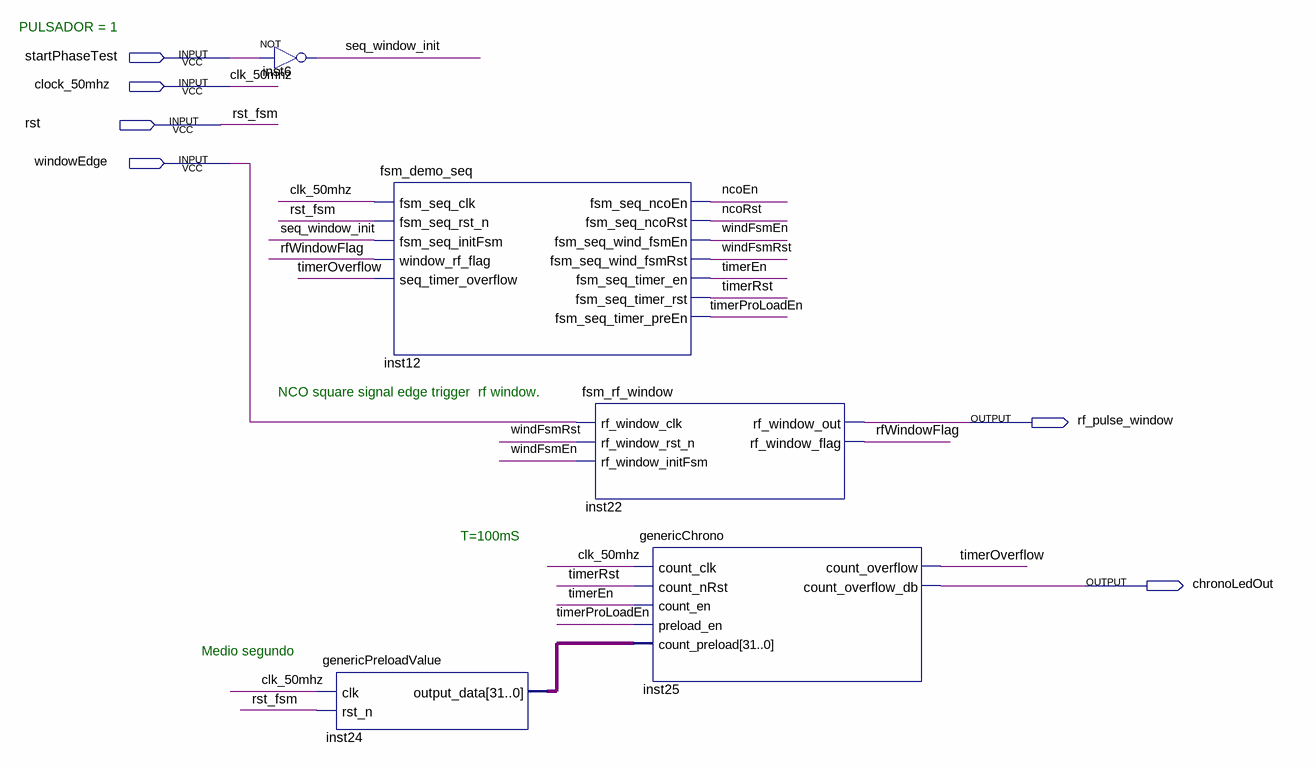
[diagram p0: schematic sheet]
// Quartus schematic block_nco_rf_pulse.bdf as structural Verilog: 5 symbols, 6 pins
module block_nco_rf_pulse (
  input  startPhaseTest,
  input  clock_50mhz,
  input  rst,
  input  windowEdge,
  output rf_pulse_window,
  output chronoLedOut
);

  wire ncoEn, ncoRst, rfWindowFlag, seq_window_init, timerEn, timerOverflow, timerProLoadEn, timerRst,
       windFsmEn, windFsmRst;
  wire [31:0] inst24_output_data;

  not inst6 (seq_window_init, startPhaseTest);
  genericPreloadValue inst24 (.clk(clock_50mhz), .rst_n(rst), .output_data(inst24_output_data));
  fsm_demo_seq inst12 (
    .fsm_seq_clk(clock_50mhz), .fsm_seq_rst_n(rst), .fsm_seq_initFsm(seq_window_init),
    .window_rf_flag(rfWindowFlag), .seq_timer_overflow(timerOverflow), .fsm_seq_ncoEn(ncoEn),
    .fsm_seq_ncoRst(ncoRst), .fsm_seq_wind_fsmEn(windFsmEn), .fsm_seq_wind_fsmRst(windFsmRst),
    .fsm_seq_timer_en(timerEn), .fsm_seq_timer_rst(timerRst), .fsm_seq_timer_preEn(timerProLoadEn));
  fsm_rf_window inst22 (
    .rf_window_clk(windowEdge), .rf_window_rst_n(windFsmRst), .rf_window_initFsm(windFsmEn),
    .rf_window_out(rf_pulse_window), .rf_window_flag(rfWindowFlag));
  genericChrono inst25 (
    .count_clk(clock_50mhz), .count_nRst(timerRst), .count_en(timerEn), .preload_en(timerProLoadEn),
    .count_preload(inst24_output_data), .count_overflow(timerOverflow), .count_overflow_db(chronoLedOut));

  // Other names for the same wires on the sheet: clk_50mhz = clock_50mhz; rst_fsm = rst

  // Notes on the sheet:
  //   PULSADOR = 1
  //   NCO square signal edge trigger  rf window.
  //   T=100mS
  //   Medio segundo
endmodule
